# EAGLE design ir_ring_2022_neu_03 (EAGLE 9.6.2)
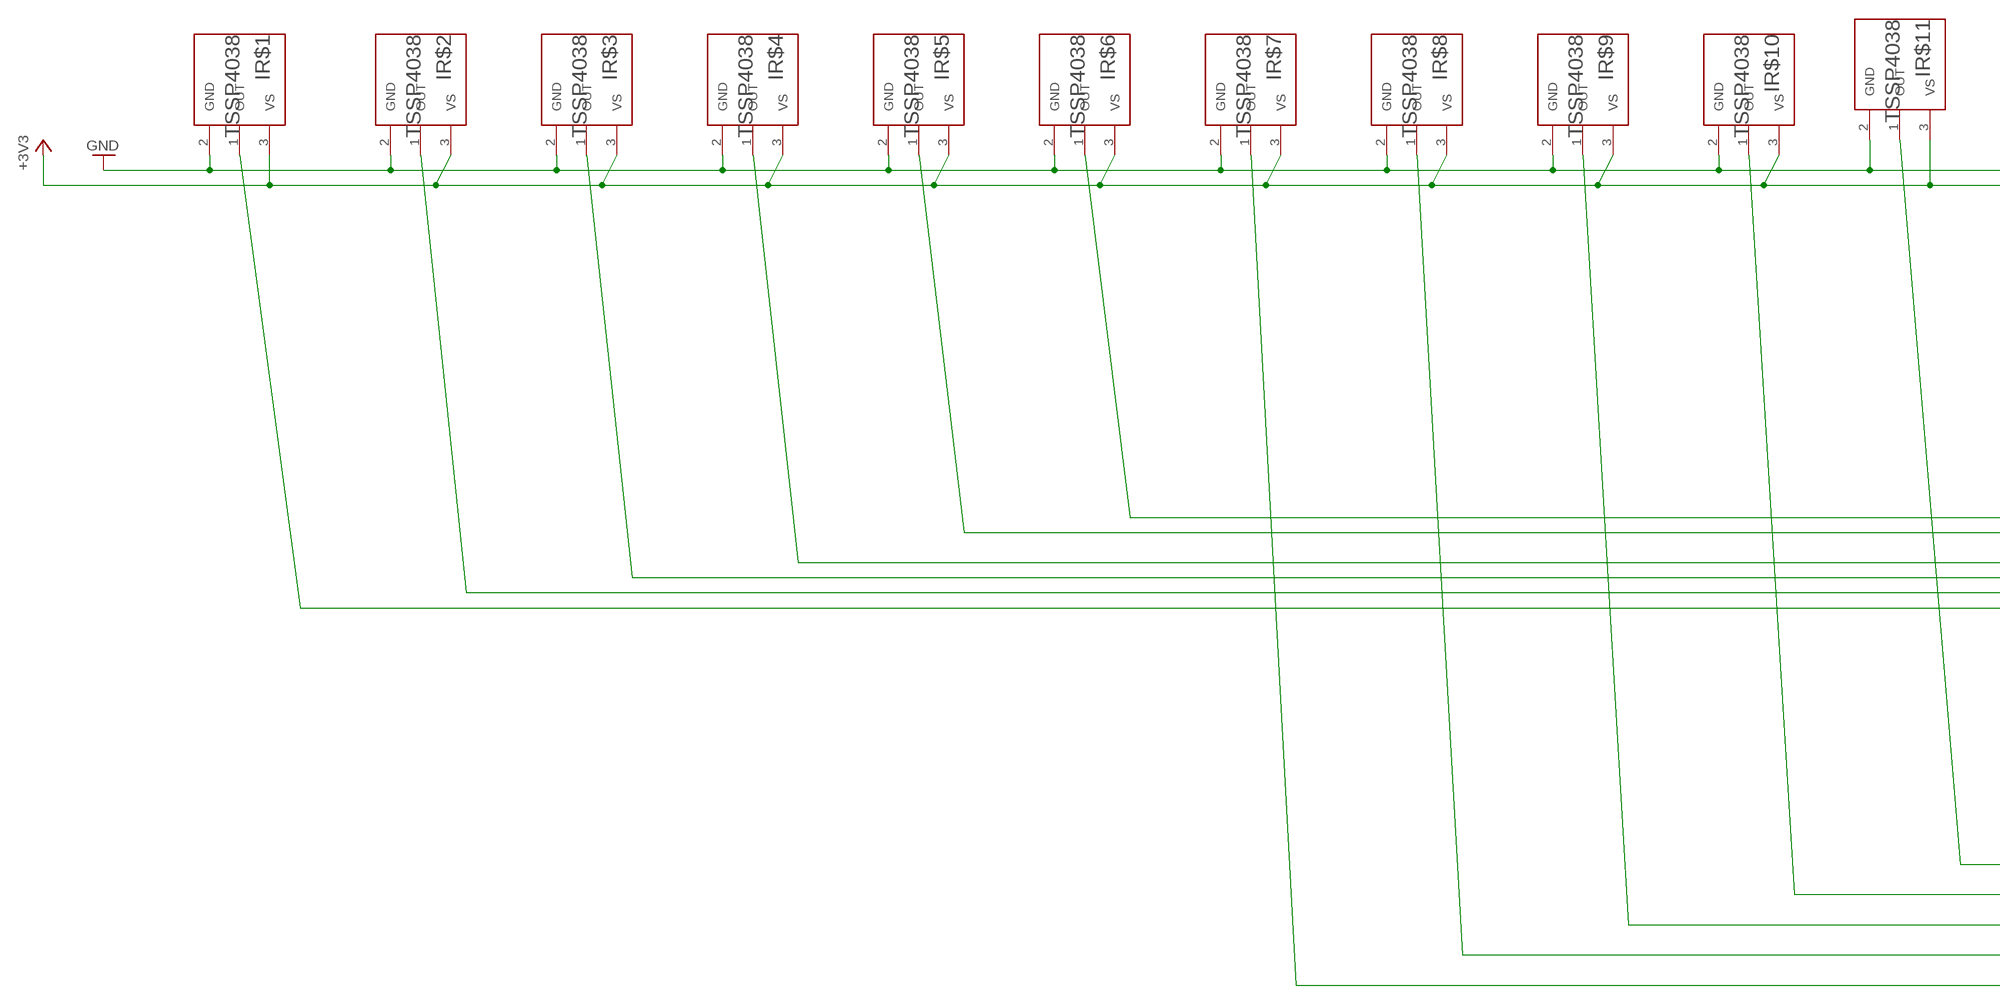
[diagram p0: schematic, sheet 1, part 1 of 2]
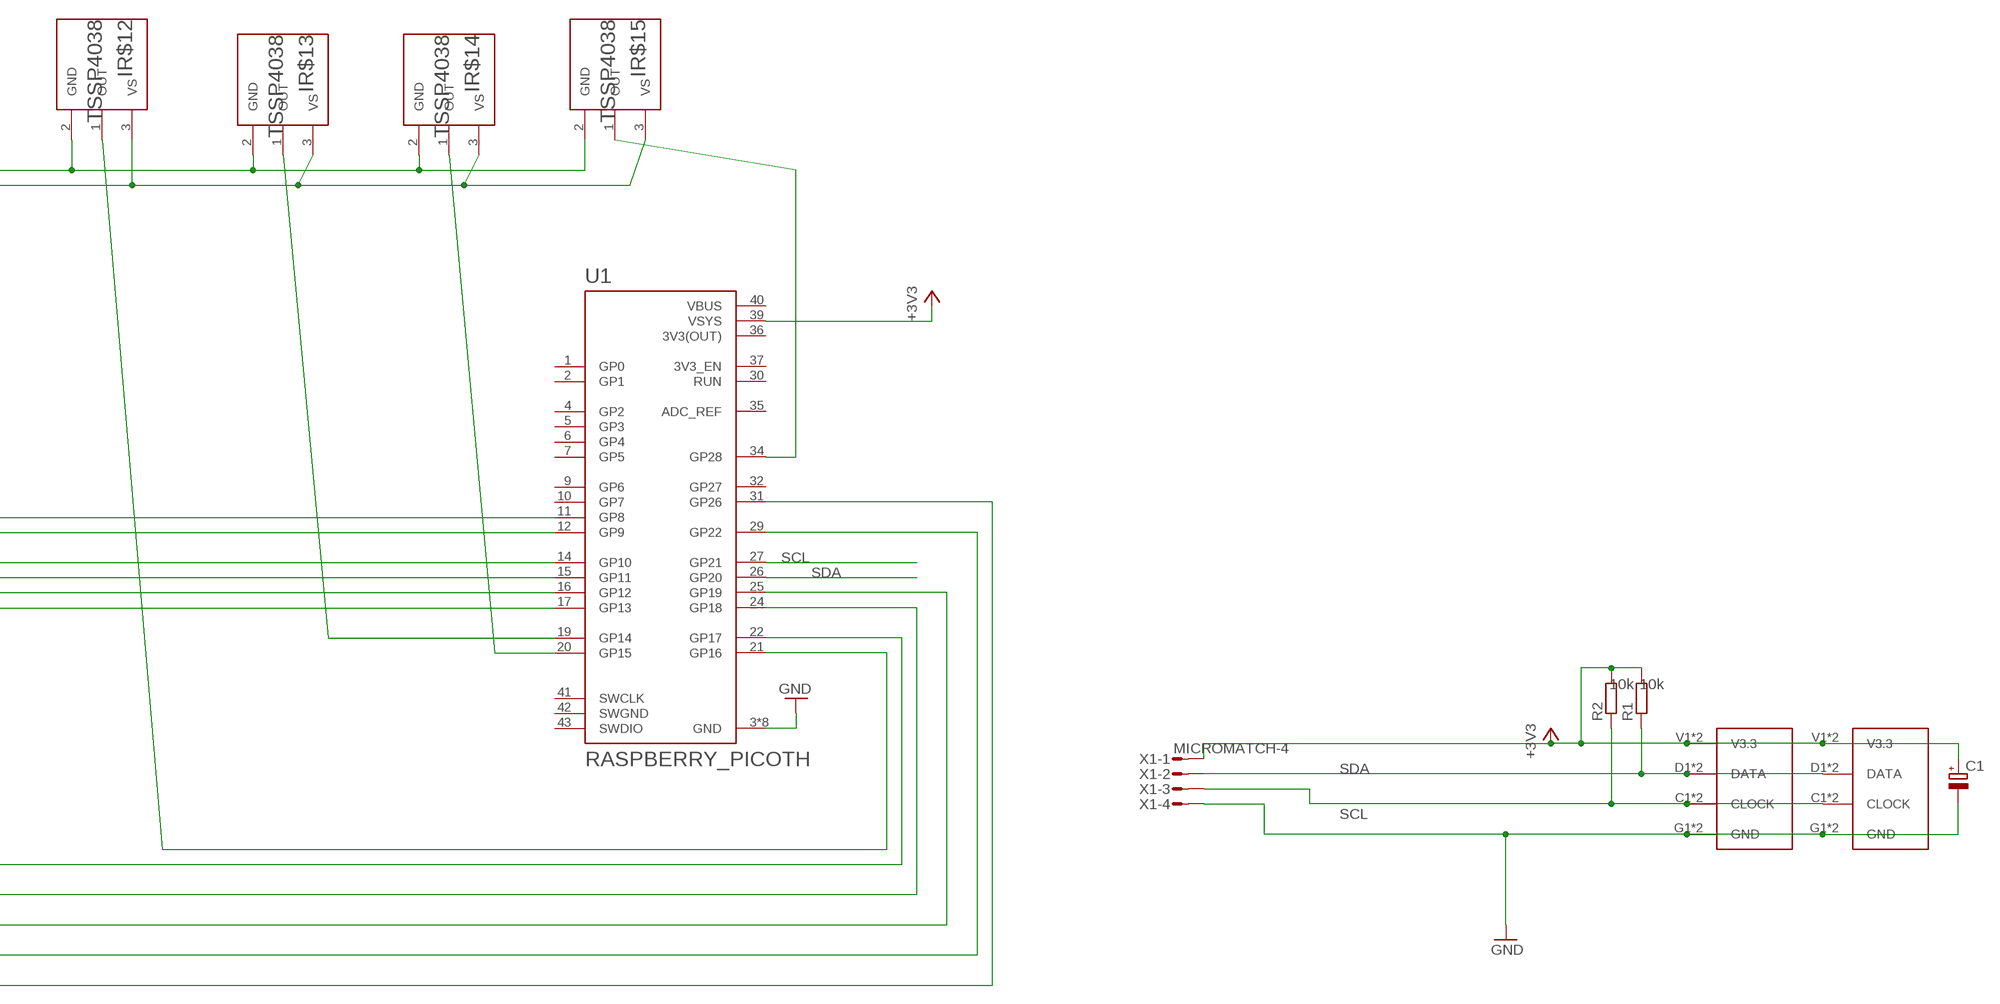
[diagram p1: schematic, sheet 1, part 2 of 2]

## Parts
C1  CPOL-EUE2-5  [E2-5]
IR$1  TSSP4038  [XDCR_TSSP4038]
IR$2  TSSP4038  [XDCR_TSSP4038]
IR$3  TSSP4038  [XDCR_TSSP4038]
IR$4  TSSP4038  [XDCR_TSSP4038]
IR$5  TSSP4038  [XDCR_TSSP4038]
IR$6  TSSP4038  [XDCR_TSSP4038]
IR$7  TSSP4038  [XDCR_TSSP4038]
IR$8  TSSP4038  [XDCR_TSSP4038]
IR$9  TSSP4038  [XDCR_TSSP4038]
IR$10  TSSP4038  [XDCR_TSSP4038]
IR$11  TSSP4038  [XDCR_TSSP4038]
IR$12  TSSP4038  [XDCR_TSSP4038]
IR$13  TSSP4038  [XDCR_TSSP4038]
IR$14  TSSP4038  [XDCR_TSSP4038]
IR$15  TSSP4038  [XDCR_TSSP4038]
R1  10k  R-EU_0204/7  [0204/7]
R2  10k  R-EU_0204/7  [0204/7]
U1  RASPBERRY_PICOTH  [PICO-PKG-TH]
U$1  TASTER_LED  [TASTER_LED]
U$2  TASTER_LED  [TASTER_LED]
X1  MICROMATCH-4  [MICROMATCH-4]

## Nets
+3V3: C1.+ IR$1.3(VS) IR$2.3(VS) IR$3.3(VS) IR$4.3(VS) IR$5.3(VS) IR$6.3(VS) IR$7.3(VS) IR$8.3(VS) IR$9.3(VS) IR$10.3(VS) IR$11.3(VS) IR$12.3(VS) IR$13.3(VS) IR$14.3(VS) IR$15.3(VS) R1.2 R2.2 U1.39(VSYS) U$1.V1(V3.3) U$1.V2(V3.3) U$2.V1(V3.3) U$2.V2(V3.3) X1.1
GND: C1.- IR$1.2(GND) IR$2.2(GND) IR$3.2(GND) IR$4.2(GND) IR$5.2(GND) IR$6.2(GND) IR$7.2(GND) IR$8.2(GND) IR$9.2(GND) IR$10.2(GND) IR$11.2(GND) IR$12.2(GND) IR$13.2(GND) IR$14.2(GND) IR$15.2(GND) U1.3(GND) U1.8(GND) U1.13(GND) U1.18(GND) U1.23(GND) U1.28(GND) U1.33(GND) U1.38(GND) U$1.G1(GND) U$1.G2(GND) U$2.G1(GND) U$2.G2(GND) X1.4
N$1: IR$1.1(OUT) U1.17(GP13)
N$2: IR$2.1(OUT) U1.16(GP12)
N$3: IR$3.1(OUT) U1.15(GP11)
N$4: IR$4.1(OUT) U1.14(GP10)
N$5: IR$5.1(OUT) U1.12(GP9)
N$6: IR$6.1(OUT) U1.11(GP8)
N$7: IR$7.1(OUT) U1.31(GP26)
N$8: IR$8.1(OUT) U1.29(GP22)
N$9: IR$9.1(OUT) U1.25(GP19)
N$10: IR$10.1(OUT) U1.24(GP18)
N$11: IR$11.1(OUT) U1.22(GP17)
N$12: IR$12.1(OUT) U1.21(GP16)
N$13: IR$14.1(OUT) U1.20(GP15)
N$14: IR$13.1(OUT) U1.19(GP14)
N$15: IR$15.1(OUT) U1.34(GP28)
SCL: R2.1 U1.27(GP21) U$1.C1(CLOCK) U$1.C2(CLOCK) U$2.C1(CLOCK) U$2.C2(CLOCK) X1.3
SDA: R1.1 U1.26(GP20) U$1.D1(DATA) U$1.D2(DATA) U$2.D1(DATA) U$2.D2(DATA) X1.2
Unconnected: U1.1(GP0) U1.2(GP1) U1.4(GP2) U1.5(GP3) U1.6(GP4) U1.7(GP5) U1.9(GP6) U1.10(GP7) U1.30(RUN) U1.32(GP27) U1.35(ADC_REF) U1.37(3V3_EN) U1.41(SWCLK) U1.43(SWDIO)

## Power pins joined to a net without a drawn wire
3V3(OUT): U1.36(3V3(OUT))
SWGND: U1.42(SWGND)
VBUS: U1.40(VBUS)

## Library data of the parts
C1 = rcl:CPOL-EU: POLARIZED CAPACITOR, European symbol; SPICEPREFIX: C
IR$1-IR$15 = TSSP4038:TSSP4038: Check availability <https://pricing.snapeda.com/parts/TSSP4038/Vishay%20Semiconductor/view-part?ref=eda>; AVAILABILITY: In Stock; DESCRIPTION: Remote Receiver Sensor, 38.0kHz 1m PCB, Through Hole; MF: Vishay Semiconductor; MP: TSSP4038; PACKAGE: None; PRICE: None; PURCHASE-URL: https://pricing.snapeda.com/search/part/TSSP4038/?ref=eda
R1 R2 = rcl:R-EU_: RESISTOR, European symbol; SPICEPREFIX: R
U1 = RpiPico:RASPBERRY_PICO: Raspberry Pi Pico
U$1 U$2 = Taster_LED:TASTER_LED: Taster / LED Board mit 2 Tastern und 2 LEDs Angeschlossen über i2c Port Expander PCF8574TS i2c Adresse zwingend per Lötbrücke zu setzen.
X1 = con-amp-micromatch:MICROMATCH-4: MicroMaTch 4 7-215464-4 / 0-215464-4 Drawing Number C-215464 DDEController.pdf; MPN: 7-215464-4; OC_FARNELL: 3784629; OC_NEWARK: 19R8124

## Board
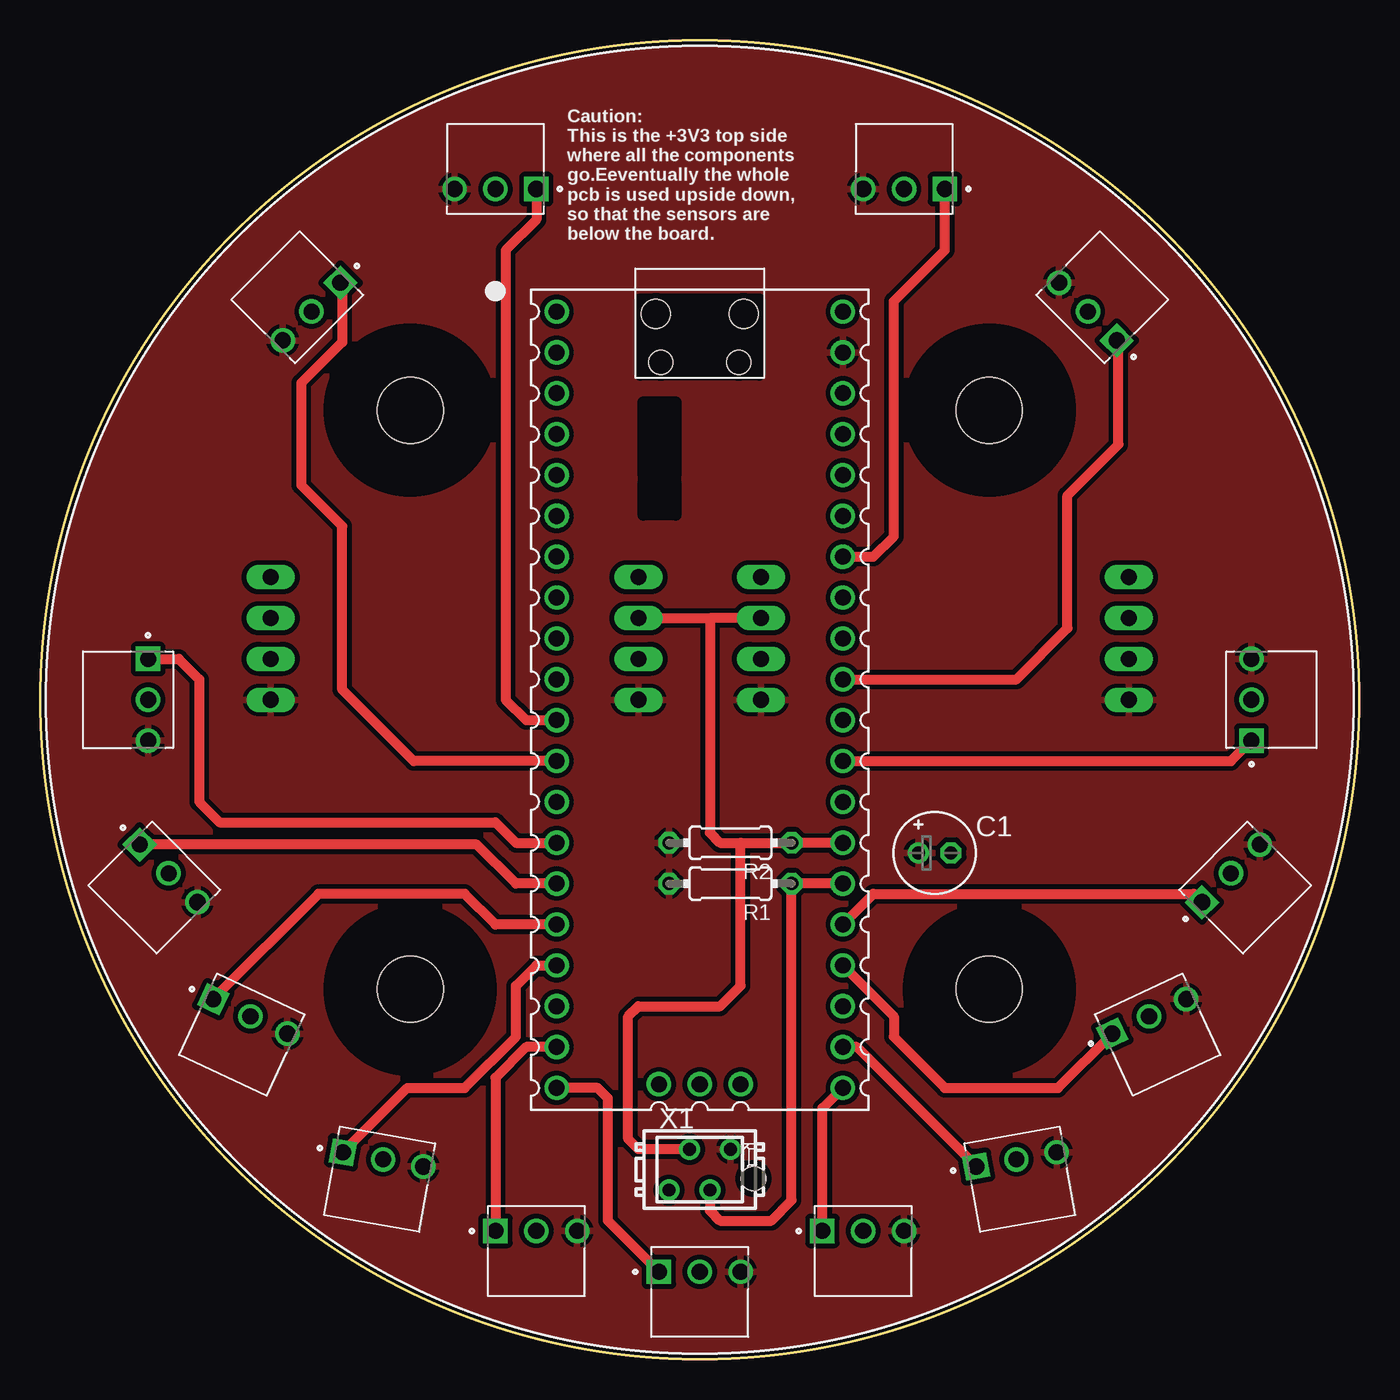
[diagram p2: board, top side]
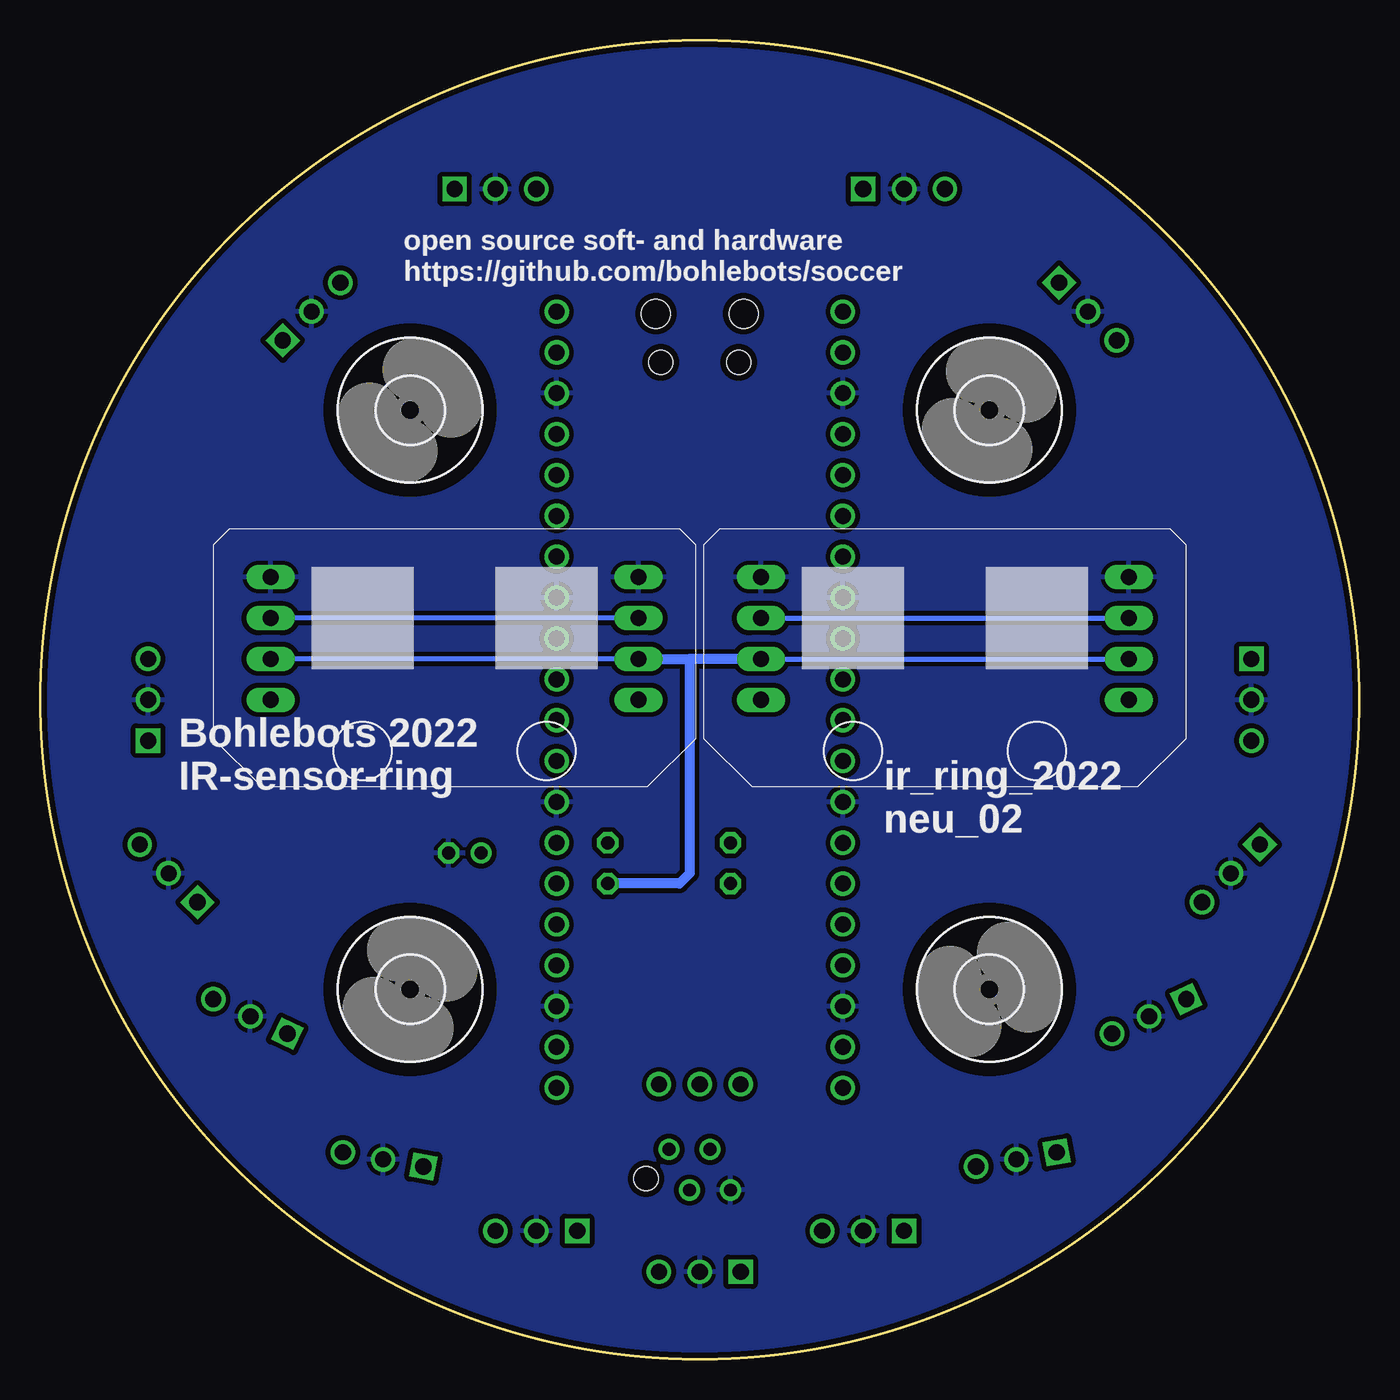
[diagram p3: board, bottom side, seen from below]

Size 82 x 82 mm. Coordinates in mm from the lower left corner, seen from the top.
Outline: circle at 41,41 radius 41
Copper layers (1*16): Top 0.035mm / dielectric 1.5mm / Bottom 0.035mm
Design rules "Normal-Pitch 2Layer": minimum track width 8mil, minimum drill 8mil, track to track 8mil, track to pad 8mil, pad to pad 8mil, via to via 8mil, smd to smd 8mil, copper to edge 15mil, drill to drill 8mil, minimum pad ring 10mil, minimum via ring 8mil, stop-mask expansion 0mil, vias tented up to drill 0mil, thermal gap 10mil

### Footprints (pad centres in the part's own frame; a part is rotated, then mirrored left to right if it is on the bottom)
E2-5 = drill 0.813 pad 1.27: + -1.016,0 | drill 0.813 pad 1.27 octagon: - 1.016,0
4,1 = hole 4.1: 0,0
XDCR_TSSP4038 = drill 1.01 square: 1 -2.54,0 | drill 1.01: 2 0,0; 3 2.54,0
0204/7 = drill 0.813 octagon: 1 -3.81,0; 2 3.81,0
PICO-PKG-TH = drill 1: 1 -8.89,24.13; 2 -8.89,21.59; 3 -8.89,19.05; 4 -8.89,16.51; 5 -8.89,13.97; 6 -8.89,11.43; 7 -8.89,8.89; 8 -8.89,6.35; 9 -8.89,3.81; 10 -8.89,1.27; 11 -8.89,-1.27; 12 -8.89,-3.81; 13 -8.89,-6.35; 14 -8.89,-8.89; 15 -8.89,-11.43; 16 -8.89,-13.97; 17 -8.89,-16.51; 18 -8.89,-19.05; 19 -8.89,-21.59; 20 -8.89,-24.13; 21 8.89,-24.13; 22 8.89,-21.59; 23 8.89,-19.05; 24 8.89,-16.51; 25 8.89,-13.97; 26 8.89,-11.43; 27 8.89,-8.89; 28 8.89,-6.35; 29 8.89,-3.81; 30 8.89,-1.27; 31 8.89,1.27; 32 8.89,3.81; 33 8.89,6.35; 34 8.89,8.89; 35 8.89,11.43; 36 8.89,13.97; 37 8.89,16.51; 38 8.89,19.05; 39 8.89,21.59; 40 8.89,24.13; 41 -2.54,-23.9; 42 0,-23.9; 43 2.54,-23.9 | hole 1.8: -2.725,24; 2.725,24 | hole 1.5: -2.425,20.97; 2.425,20.97
TASTER_LED = drill 1 long: C1 -11.43,-4.445; C2 11.43,-4.445; D1 -11.43,-1.905; D2 11.43,-1.905; G1 -11.43,-6.985; G2 11.43,-6.985; V1 -11.43,0.635; V2 11.43,0.635
MICROMATCH-4 = drill 0.8: 1 1.905,1.27; 2 0.635,-1.27; 3 -0.635,1.27; 4 -1.905,-1.27 | hole 1.5: 3.34,-0.55

### Placement (x,y rotation side)
C1  55.61,31.48 0 top
H1  MOUNT-HOLE4.1  [4,1]  23,59 22.5 bottom
H3  MOUNT-HOLE4.1  [4,1]  59,23 22.5 bottom
H6  MOUNT-HOLE4.1  [4,1]  23,23 337.5 bottom
H8  MOUNT-HOLE4.1  [4,1]  59,59 0 bottom
IR$1  21.32,12.43 350 top
IR$2  13.06,21.32 335 top
IR$3  7.98,30.2 315 top
IR$4  6.71,41 270 top
IR$5  16.87,65.13 225 top
IR$6  28.3,72.75 180 top
IR$7  65.13,65.13 135 top
IR$8  75.29,41 90 top
IR$9  74.02,30.2 45 top
IR$10  68.94,21.32 25 top
IR$11  60.69,12.43 10 top
IR$12  51.16,7.98 0 top
IR$13  30.84,7.98 0 top
IR$14  41,5.44 0 top
IR$15  53.7,72.75 180 top
R1  42.91,29.57 180 top
R2  42.91,32.11 180 top
U1  41,41 0 top
U$1  56.24,41.63 180 bottom
U$2  25.76,41.63 180 bottom
X1  41,11.79 0 top

### Tracks (layer width: path | path; a pad name or v marks a point on that pad's centre or on a via)
+3V3
  pour Top (isolate 0.305, rank 2): -2.81,84.18 84.18,84.18 84.18,-2.81 -2.81,-2.81
GND
  pour Bottom (isolate 0.305): -20.59,39.73 arc-90 39.73,100.06 arc-90 99.42,40.37 arc-90 39.09,-19.96 arc-90
N$1
  Top 0.61: IR$1.1 22.82,16.87 26.39,16.87 29.57,20.05 29.57,23.22 30.84,24.49 U1.17
N$2
  Top 0.61: U1.16 28.3,27.03 26.39,28.94 17.3,28.94 IR$2.1
N$3
  Top 0.61: U1.15 29.57,29.57 27.14,32 IR$3.1
N$4
  Top 0.61: IR$4.1 8.62,43.54 9.89,42.27 9.89,34.65 11.16,33.38 28.3,33.38 29.57,32.11 U1.14
N$5
  Top 0.61: U1.12 23.22,37.19 18.77,41.63 18.77,51.8 16.23,54.34 16.23,60.69 18.77,63.23 18.77,66.82 IR$5.1
N$6
  Top 0.61: IR$6.1 30.84,70.84 28.94,68.94 28.94,41 30.2,39.73 U1.11
N$7
  Top 0.61: U1.31 60.69,42.27 63.86,45.45 63.86,53.7 67.03,56.88 67.03,63.23 IR$7.1
N$8
  Top 0.61: U1.29 74.02,37.19 IR$8.1
N$9
  Top 0.61: U1.25 51.8,28.94 71.7,28.94 IR$9.1
N$10
  Top 0.61: U1.24 53.06,21.32 53.06,20.05 56.24,16.87 63.27,16.87 IR$10.1
N$11
  Top 0.61: IR$11.1 50.76,19.41 U1.22
N$12
  Top 0.61: IR$12.1 48.62,15.6 U1.21
N$13
  Top 0.61: IR$14.1 35.28,8.62 35.28,16.23 34.65,16.87 U1.20
N$14
  Top 0.61: U1.19 30.2,19.41 28.3,17.5 IR$13.1
N$15
  Top 0.61: U1.34 51.8,49.89 53.06,51.16 53.06,65.77 56.24,68.94 IR$15.1
SCL
  Top 0.61: U1.27 R2.1 | X1.3 37.19,13.06 36.55,13.7 36.55,21.32 37.19,21.95 42.27,21.95 43.54,23.22 43.54,32.11 R2.1 | 41.63,46.08 41.63,32.74 42.27,32.11 R2.1 | U$2.C2 41.63,46.08 | U$1.C1 41.63,46.08
  Bottom 0.305: U$2.C2 U$2.C1 | U$1.C1 U$1.C2
SDA
  Top 0.61: U1.26 R1.1 46.72,9.89 45.45,8.62 42.27,8.62 41.63,9.25 X1.2
  Bottom 0.305: U$2.D2 U$2.D1 | U$1.D1 U$1.D2
  Bottom 0.61: R1.1 42.27,29.57 41.63,30.2 41.63,43.54 | U$2.D2 41.63,43.54 | U$1.D1 41.63,43.54

### Text on the board
bPlace: open source soft- and hardware / https://github.com/bohlebots/soccer | ir_ring_2022 / neu_02 | Bohlebots 2022 / IR-sensor-ring
tNames: Caution: / This is the +3V3 top side / where all the components / go.Eeventually the whole / pcb is used upside down, / so that the sensors are / below the board.